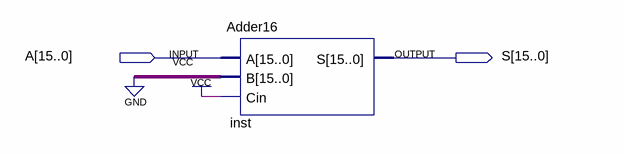
[diagram p0: schematic sheet]
// Quartus schematic Adder16a1.bdf as structural Verilog: 1 symbols, 2 pins
module Adder16a1 (
  input  [15:0] A,
  output [15:0] S
);

  Adder16 inst (.A(A), .B({16{1'b0}}), .Cin(1'b1), .S(S));
endmodule
